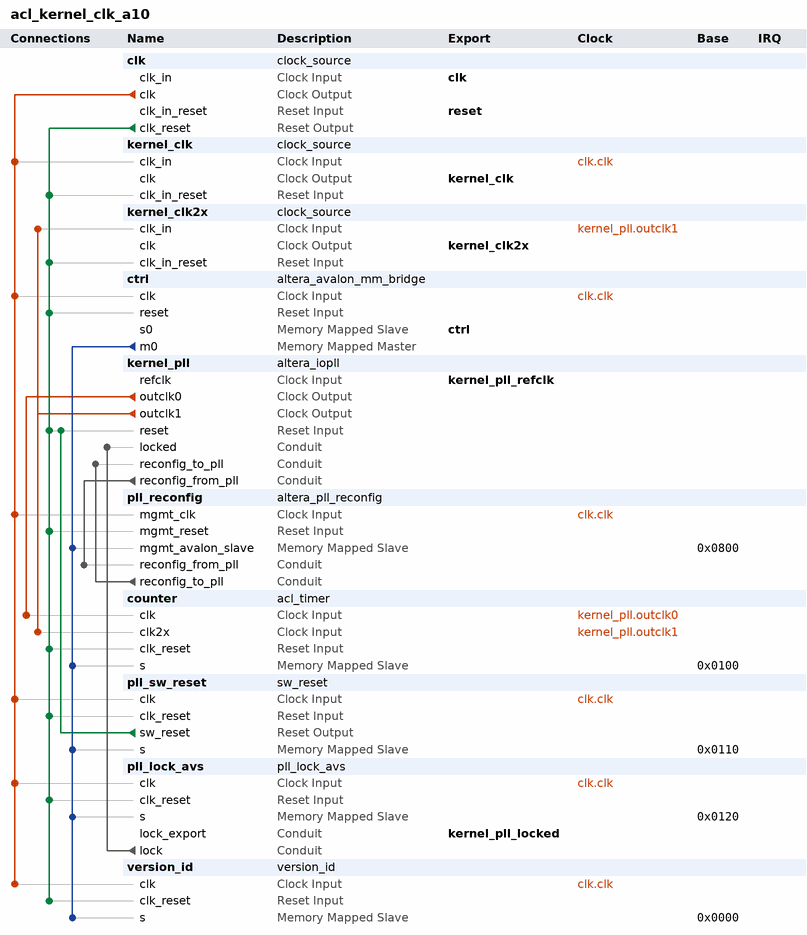
[diagram p0: system contents]
# Platform Designer (Qsys) system acl_kernel_clk_a10, Arria 10 10AX115S2F45I1SG
# Parameters at their usual value, and those the tool derives, are not listed.
package require -exact qsys 16.0
create_system acl_kernel_clk_a10
set_project_property DEVICE_FAMILY {Arria 10}
set_project_property DEVICE 10AX115S2F45I1SG

add_instance clk clock_source 16.0
set_instance_parameter_value clk clockFrequency 50000000
set_instance_parameter_value clk resetSynchronousEdges DEASSERT

add_instance kernel_clk clock_source 16.0
set_instance_parameter_value kernel_clk clockFrequency 50000000
set_instance_parameter_value kernel_clk clockFrequencyKnown false

add_instance kernel_clk2x clock_source 16.0
set_instance_parameter_value kernel_clk2x clockFrequency 100000000
set_instance_parameter_value kernel_clk2x clockFrequencyKnown false

add_instance ctrl altera_avalon_mm_bridge 16.0
set_instance_parameter_value ctrl ADDRESS_UNITS SYMBOLS
set_instance_parameter_value ctrl ADDRESS_WIDTH 12
set_instance_parameter_value ctrl DATA_WIDTH 32
set_instance_parameter_value ctrl MAX_PENDING_RESPONSES 4
set_instance_parameter_value ctrl PIPELINE_COMMAND 0
set_instance_parameter_value ctrl PIPELINE_RESPONSE 0
set_instance_parameter_value ctrl USE_AUTO_ADDRESS_WIDTH 0

add_instance kernel_pll altera_iopll 16.0
set_instance_parameter_value kernel_pll gui_actual_duty_cycle0 50.0
set_instance_parameter_value kernel_pll gui_actual_duty_cycle1 50.0
set_instance_parameter_value kernel_pll gui_actual_output_clock_frequency0 100.0
set_instance_parameter_value kernel_pll gui_actual_output_clock_frequency1 426.666667
set_instance_parameter_value kernel_pll gui_actual_phase_shift0 0.0
set_instance_parameter_value kernel_pll gui_actual_phase_shift1 0.0
set_instance_parameter_value kernel_pll gui_actual_phase_shift_deg0 0.0
set_instance_parameter_value kernel_pll gui_actual_phase_shift_deg1 0.0
set_instance_parameter_value kernel_pll gui_clock_name_global false
set_instance_parameter_value kernel_pll gui_clock_to_compensate 0
set_instance_parameter_value kernel_pll gui_device_speed_grade 1
set_instance_parameter_value kernel_pll gui_en_lvds_ports Disabled
set_instance_parameter_value kernel_pll gui_en_reconf true
set_instance_parameter_value kernel_pll gui_existing_mif_file_path {~/pll.mif}
set_instance_parameter_value kernel_pll gui_lock_setting {Low Lock Time}
set_instance_parameter_value kernel_pll gui_mif_config_name unnamed
set_instance_parameter_value kernel_pll gui_mif_gen_options {Generate New MIF File}
set_instance_parameter_value kernel_pll gui_new_mif_file_path {~/pll.mif}
set_instance_parameter_value kernel_pll gui_number_of_clocks 2
set_instance_parameter_value kernel_pll gui_operation_mode direct
set_instance_parameter_value kernel_pll gui_output_clock_frequency0 400.0
set_instance_parameter_value kernel_pll gui_output_clock_frequency1 800.0
set_instance_parameter_value kernel_pll gui_reference_clock_frequency 125.0
set_instance_parameter_value kernel_pll gui_use_NDFB_modes false
set_instance_parameter_value kernel_pll gui_use_locked true
set_instance_parameter_value kernel_pll gui_vco_frequency 600.0
set_instance_parameter_value kernel_pll system_info_device_component 10AX115S2F45I1SG
set_instance_parameter_value kernel_pll system_info_device_speed_grade 2
set_instance_parameter_value kernel_pll system_part_trait_speed_grade 1

add_instance pll_reconfig altera_pll_reconfig 16.0
set_instance_parameter_value pll_reconfig ENABLE_MIF true
set_instance_parameter_value pll_reconfig MIF_FILE_NAME pll_rom

add_instance counter acl_timer 10.0
set_instance_parameter_value counter WIDTH 32

add_instance pll_sw_reset sw_reset 10.0
set_instance_parameter_value pll_sw_reset LOG2_RESET_CYCLES 10
set_instance_parameter_value pll_sw_reset WIDTH 32

add_instance pll_lock_avs pll_lock_avs 10.0
set_instance_parameter_value pll_lock_avs WIDTH 32

add_instance version_id version_id 10.0
set_instance_parameter_value version_id VERSION_ID -1598029822
set_instance_parameter_value version_id WIDTH 32

# connections
add_connection clk.clk ctrl.clk clock
add_connection clk.clk kernel_clk.clk_in clock
add_connection clk.clk pll_lock_avs.clk clock
add_connection clk.clk pll_reconfig.mgmt_clk clock
add_connection clk.clk pll_sw_reset.clk clock
add_connection clk.clk version_id.clk clock
add_connection kernel_pll.outclk0 counter.clk clock
add_connection kernel_pll.outclk1 counter.clk2x clock
add_connection kernel_pll.outclk1 kernel_clk2x.clk_in clock
add_connection clk.clk_reset counter.clk_reset reset
add_connection clk.clk_reset ctrl.reset reset
add_connection clk.clk_reset kernel_clk2x.clk_in_reset reset
add_connection clk.clk_reset kernel_clk.clk_in_reset reset
add_connection clk.clk_reset kernel_pll.reset reset
add_connection clk.clk_reset pll_lock_avs.clk_reset reset
add_connection clk.clk_reset pll_reconfig.mgmt_reset reset
add_connection clk.clk_reset pll_sw_reset.clk_reset reset
add_connection clk.clk_reset version_id.clk_reset reset
add_connection pll_sw_reset.sw_reset kernel_pll.reset reset
add_connection ctrl.m0 counter.s avalon
set_connection_parameter_value ctrl.m0/counter.s baseAddress 0x0100
add_connection ctrl.m0 pll_lock_avs.s avalon
set_connection_parameter_value ctrl.m0/pll_lock_avs.s baseAddress 0x0120
add_connection ctrl.m0 pll_reconfig.mgmt_avalon_slave avalon
set_connection_parameter_value ctrl.m0/pll_reconfig.mgmt_avalon_slave baseAddress 0x0800
add_connection ctrl.m0 pll_sw_reset.s avalon
set_connection_parameter_value ctrl.m0/pll_sw_reset.s baseAddress 0x0110
add_connection ctrl.m0 version_id.s avalon
set_connection_parameter_value ctrl.m0/version_id.s baseAddress 0x0000
add_connection kernel_pll.reconfig_from_pll pll_reconfig.reconfig_from_pll conduit
add_connection pll_lock_avs.lock kernel_pll.locked conduit
add_connection pll_reconfig.reconfig_to_pll kernel_pll.reconfig_to_pll conduit

# exported interfaces
add_interface clk clock sink
set_interface_property clk EXPORT_OF clk.clk_in
add_interface ctrl avalon slave
set_interface_property ctrl EXPORT_OF ctrl.s0
add_interface kernel_clk clock source
set_interface_property kernel_clk EXPORT_OF kernel_clk.clk
add_interface kernel_clk2x clock source
set_interface_property kernel_clk2x EXPORT_OF kernel_clk2x.clk
add_interface kernel_pll_locked conduit end
set_interface_property kernel_pll_locked EXPORT_OF pll_lock_avs.lock_export
add_interface kernel_pll_refclk clock sink
set_interface_property kernel_pll_refclk EXPORT_OF kernel_pll.refclk
add_interface reset reset sink
set_interface_property reset EXPORT_OF clk.clk_in_reset

set_interconnect_requirement {$system} qsys_mm.clockCrossingAdapter FIFO
set_interconnect_requirement {$system} qsys_mm.maxAdditionalLatency 1

save_system acl_kernel_clk_a10.qsys
